# EAGLE design Puente H (EAGLE 7.6.0)
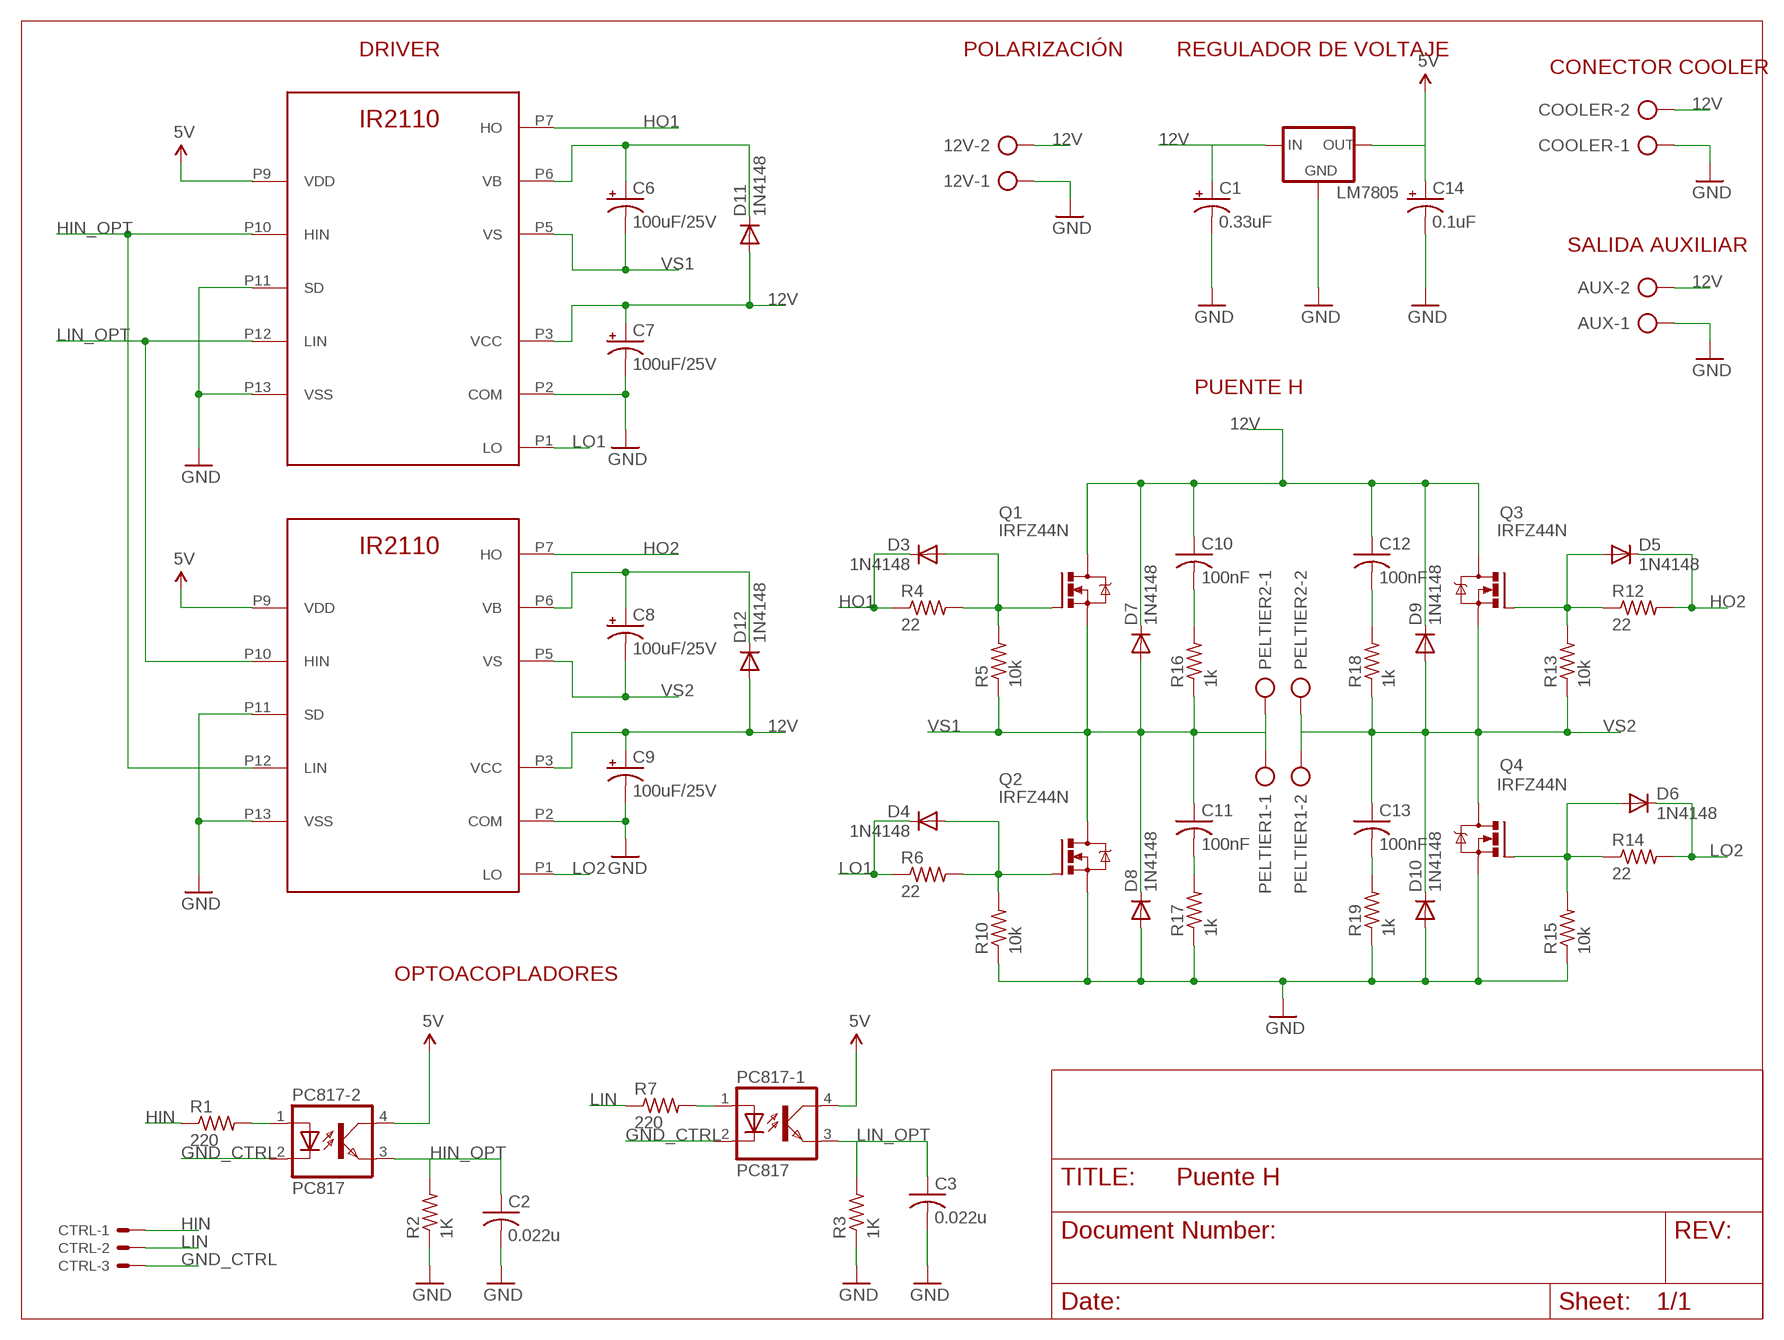
[diagram p0: schematic, sheet 1]

## Parts
12V  AK500/2  [AK500/2]
AUX  AK500/2  [AK500/2]
C1  0.33uF  CPOL-USE2.5-6  [E2,5-6]
C2  0.022u  C-US102-043X133  [C102-043X133]
C3  0.022u  C-US102-043X133  [C102-043X133]
C6  100uF/25V  CPOL-USE2.5-7  [E2,5-7]
C7  100uF/25V  CPOL-USE2.5-7  [E2,5-7]
C8  100uF/25V  CPOL-USE2.5-7  [E2,5-7]
C9  100uF/25V  CPOL-USE2.5-7  [E2,5-7]
C10  100nF  C-US025-025X050  [C025-025X050]
C11  100nF  C-US025-025X050  [C025-025X050]
C12  100nF  C-US025-025X050  [C025-025X050]
C13  100nF  C-US025-025X050  [C025-025X050]
C14  0.1uF  CPOL-USE2.5-6  [E2,5-6]
COOLER  AK500/2  [AK500/2]
CTRL  22-23-2031  [22-23-2031]
D3  1N4148  DIODE1N4148  [DIODE-1N4148]
D4  1N4148  DIODE1N4148  [DIODE-1N4148]
D5  1N4148  DIODE1N4148  [DIODE-1N4148]
D6  1N4148  DIODE1N4148  [DIODE-1N4148]
D7  1N4148  DIODE1N4148  [DIODE-1N4148]
D8  1N4148  DIODE1N4148  [DIODE-1N4148]
D9  1N4148  DIODE1N4148  [DIODE-1N4148]
D10  1N4148  DIODE1N4148  [DIODE-1N4148]
D11  1N4148  DIODE1N4148  [DIODE-1N4148]
D12  1N4148  DIODE1N4148  [DIODE-1N4148]
IR2110-1  IR2110N  [DIL14-1]
IR2110-2  IR2110N  [DIL14-1]
LM7805  78XXS  [78XXS]
PC817-1  PC817  [DIL04]
PC817-2  PC817  [DIL04]
PELTIER1  AK500/2  [AK500/2]
PELTIER2  AK500/2  [AK500/2]
Q1  IRFZ44N  IRF520  [TO220BV]
Q2  IRFZ44N  IRF520  [TO220BV]
Q3  IRFZ44N  IRF520  [TO220BV]
Q4  IRFZ44N  IRF520  [TO220BV]
R1  220  R-US_0207/10  [0207/10]
R2  1K  R-US_0207/10  [0207/10]
R3  1K  R-US_0207/10  [0207/10]
R4  22  R-US_0207/10  [0207/10]
R5  10k  R-US_0207/10  [0207/10]
R6  22  R-US_0207/10  [0207/10]
R7  220  R-US_0207/10  [0207/10]
R10  10k  R-US_0207/10  [0207/10]
R12  22  R-US_0207/10  [0207/10]
R13  10k  R-US_0207/10  [0207/10]
R14  22  R-US_0207/10  [0207/10]
R15  10k  R-US_0207/10  [0207/10]
R16  1k  R-US_0207/10  [0207/10]
R17  1k  R-US_0207/10  [0207/10]
R18  1k  R-US_0207/10  [0207/10]
R19  1k  R-US_0207/10  [0207/10]

## Nets
5V: C14.+ IR2110-1.P9(VDD) IR2110-2.P9(VDD) LM7805.OUT PC817-1.4(COL) PC817-2.4(COL)
12V: 12V.2 AUX.2 C1.+ C7.+ C9.+ C10.1 C12.1 COOLER.2 D7.C D9.C D11.A D12.A IR2110-1.P3(VCC) IR2110-2.P3(VCC) LM7805.IN Q1.D Q3.D
GND: 12V.1 AUX.1 C1.- C2.2 C3.2 C7.- C9.- C14.- COOLER.1 D8.A D10.A IR2110-1.P2(COM) IR2110-1.P11(SD) IR2110-1.P13(VSS) IR2110-2.P2(COM) IR2110-2.P11(SD) IR2110-2.P13(VSS) LM7805.GND Q2.S Q4.S R2.1 R3.1 R10.1 R15.1 R17.1 R19.1
GND_CTRL: CTRL.3 PC817-1.2(C) PC817-2.2(C)
HIN: CTRL.1 R1.1
HIN_OPT: C2.1 IR2110-1.P10(HIN) IR2110-2.P12(LIN) PC817-2.3(EMIT) R2.2
HO1: D3.C IR2110-1.P7(HO) R4.1
HO2: D5.C IR2110-2.P7(HO) R12.2
LIN: CTRL.2 R7.1
LIN_OPT: C3.1 IR2110-1.P12(LIN) IR2110-2.P10(HIN) PC817-1.3(EMIT) R3.2
LO1: D4.C IR2110-1.P1(LO) R6.1
LO2: D6.C IR2110-2.P1(LO) R14.2
N$3: PC817-1.1(A) R7.2
N$4: PC817-2.1(A) R1.2
N$6: D5.A Q3.G R12.1 R13.2
N$7: C6.+ D11.C IR2110-1.P6(VB)
N$9: D3.A Q1.G R4.2 R5.2
N$10: D4.A Q2.G R6.2 R10.2
N$11: D6.A Q4.G R14.1 R15.2
N$12: C12.2 R18.2
N$13: C10.2 R16.2
N$14: C13.2 R19.2
N$15: C11.2 R17.2
N$19: C8.+ D12.C IR2110-2.P6(VB)
VS1: C6.- C11.1 D7.A D8.C IR2110-1.P5(VS) PELTIER1.1 PELTIER2.1 Q1.S Q2.D R5.1 R16.1
VS2: C8.- C13.1 D9.A D10.C IR2110-2.P5(VS) PELTIER1.2 PELTIER2.2 Q3.S Q4.D R13.1 R18.1

## Notes on the sheet
- DRIVER | POLARIZACIÓN | REGULADOR DE VOLTAJE
- CONECTOR COOLER
- SALIDA AUXILIAR
- PUENTE H
- OPTOACOPLADORES

## Library data of the parts
12V AUX COOLER PELTIER1 PELTIER2 = con-ptr500:AK500/2: CONNECTOR; OC_FARNELL: unknown; OC_NEWARK: unknown
C1 C6-C9 C14 = rcl:CPOL-US: POLARIZED CAPACITOR, American symbol
C2 C3 C10-C13 = rcl:C-US: CAPACITOR, American symbol
CTRL = con-molex:22-23-2031: .100" (2.54mm) Center Header - 3 Pin; MF: MOLEX; MPN: 22-23-2031; OC_FARNELL: 1462950; OC_NEWARK: 30C0862
D3-D12 = SparkFun:DIODE: Diode These are standard reverse protection diodes and small signal diodes. SMA package can handle up to about 1A. SOD-323 can handle about 200mA. What the SOD-323 package when ordering, there are some mfgs out there that are 5-pin packages.
IR2110-1 IR2110-2 = PWM:IR2110
LM7805 = v-reg:78XXS: VOLTAGE REGULATOR
PC817-1 PC817-2 = optocoupler:PC817: SHARP OPTO COUPLER; MPN: PC817X4J000F; OC_FARNELL: 9707727; OC_NEWARK: 97K7059
Q1-Q4 = transistor-power:IRF520: HEXFET Power MOSFET
R1-R7 R10 R12-R19 = rcl:R-US_: RESISTOR, American symbol

## Board
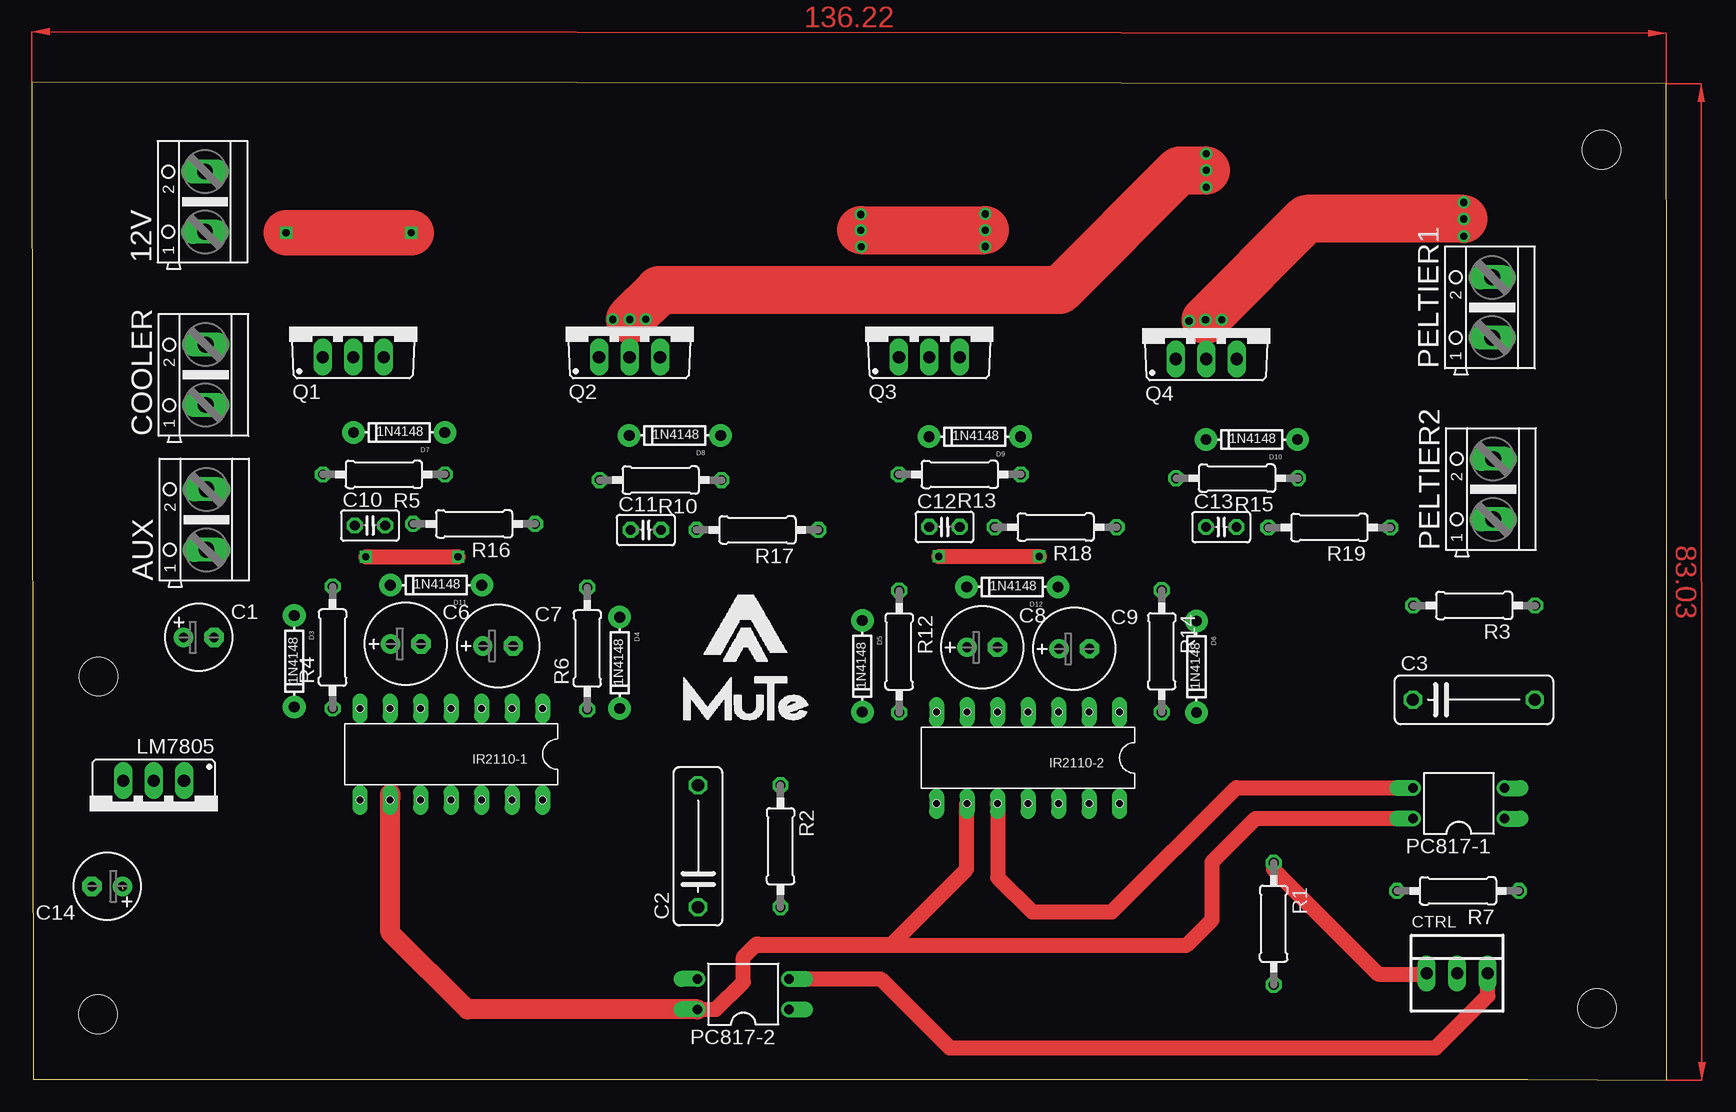
[diagram p1: board, top side]
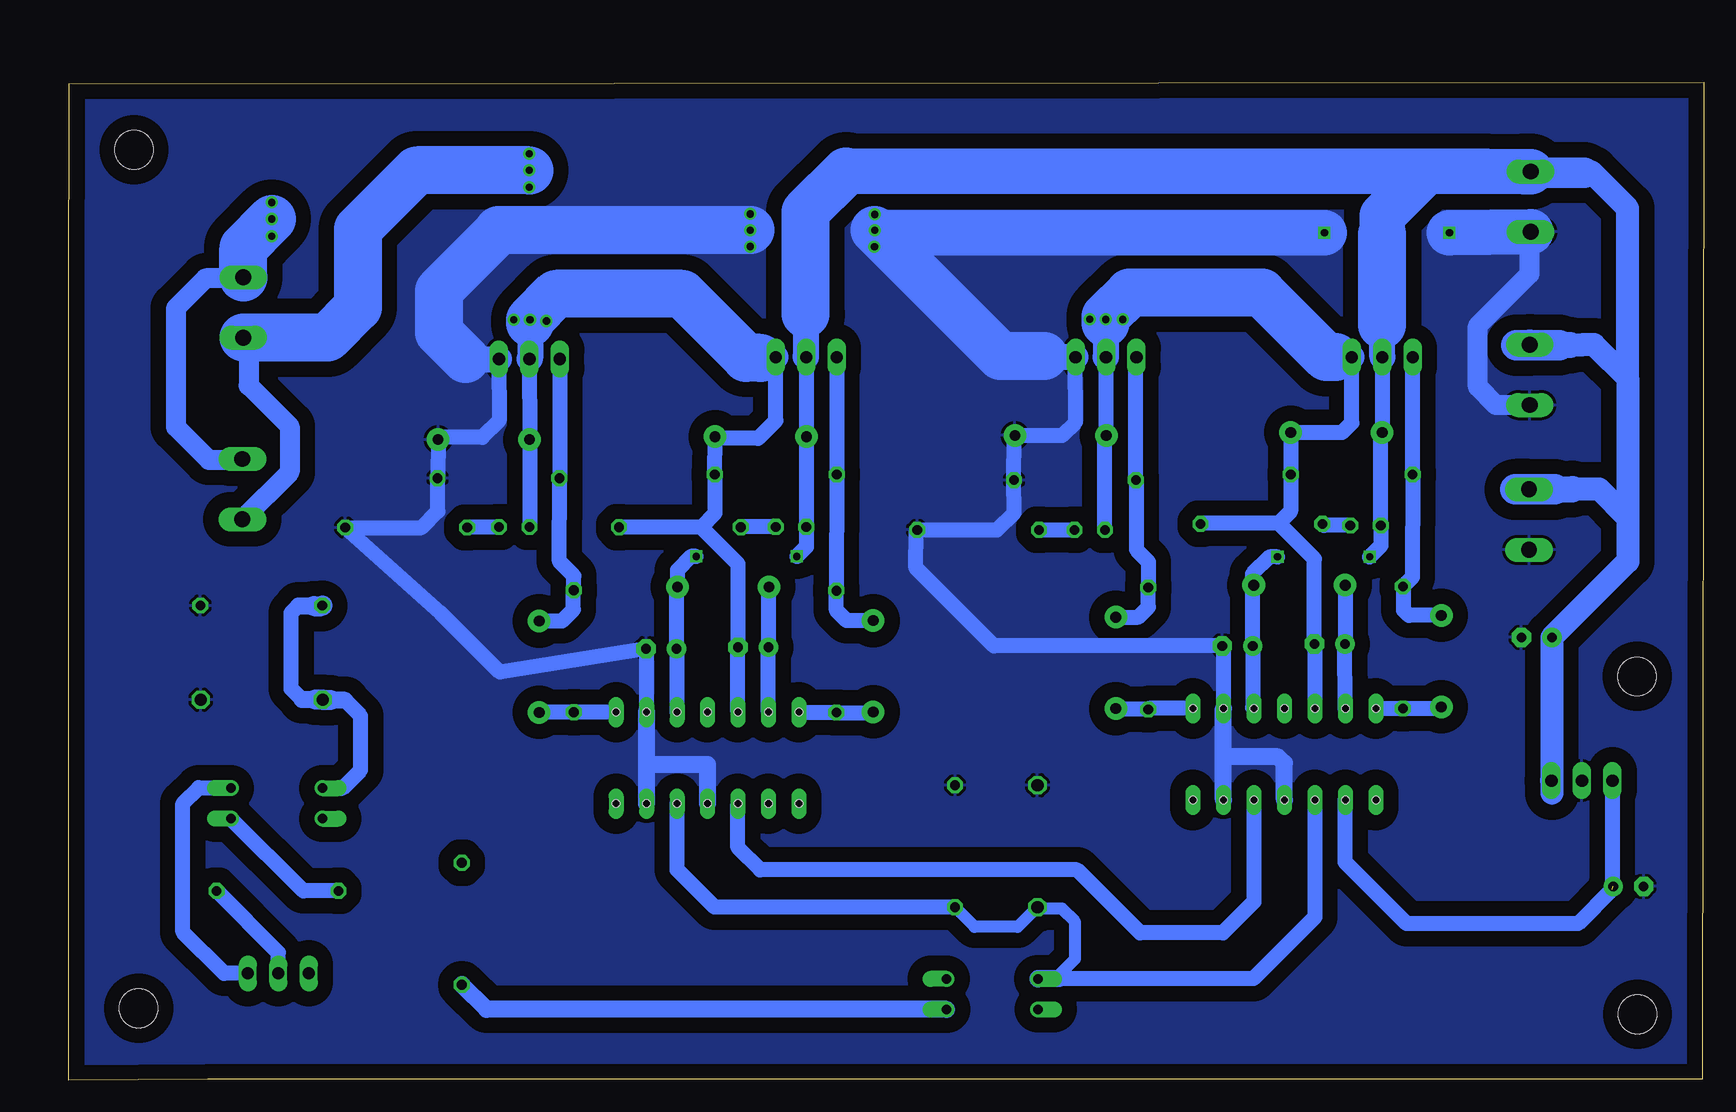
[diagram p2: board, bottom side, seen from below]

Size 136.28 x 83.16 mm. Coordinates in mm from the lower left corner, seen from the top.
Outline: 0.15,0.06 124.67,0.08 136.28,0 136.25,63.74 136.22,83.03 0,83.16 0.15,0.06
Copper layers (1*16): Top 0.035mm / dielectric 1.5mm / Bottom 0.035mm
Design rules "default": minimum track width 10mil, minimum drill 24mil, track to track 8mil, track to pad 8mil, pad to pad 8mil, via to via 8mil, smd to smd 8mil, copper to edge 40mil, drill to drill 8mil, minimum pad ring 10mil, minimum via ring 8mil, stop-mask expansion 4mil, vias tented up to drill 0mil, thermal gap 10mil
Holes 3.2 mm at 5.57,33.65 130.45,5.99 130.83,77.53 5.54,5.49

### Footprints (pad centres in the part's own frame; a part is rotated, then mirrored left to right if it is on the bottom)
AK500/2 = drill 1.321 long: 1 -2.515,0; 2 2.515,0
E2,5-6 = drill 0.813 pad 1.6: + -1.27,0 | drill 0.813 pad 1.6 octagon: - 1.27,0
C102-043X133 = drill 1.016 octagon: 1 -5.08,0; 2 5.08,0
E2,5-7 = drill 0.813 pad 1.6: + -1.27,0 | drill 0.813 pad 1.6 octagon: - 1.27,0
C025-025X050 = drill 0.813 octagon: 1 -1.27,0; 2 1.27,0
22-23-2031 = drill 1 long: 1 -2.54,0; 2 0,0; 3 2.54,0
DIODE-1N4148 = drill 0.9 pad 1.88: A -3.81,0; C 3.81,0
DIL14-1 = drill 0.406 pad 1.27 long: P1 -8.89,-3.81; P2 -6.35,-3.81; P3 -3.81,-3.81; P4 -1.27,-3.81; P5 1.27,-3.81; P6 3.81,-3.81; P7 6.35,-3.81; P8 6.35,3.81; P9 3.81,3.81; P10 1.27,3.81; P11 -1.27,3.81; P12 -3.81,3.81; P13 -6.35,3.81; P14 -8.89,3.81 | hole 0.61: -8.89,-3.81; -6.35,-3.81; -3.81,-3.81; -1.27,-3.81; 1.27,-3.81; 3.81,-3.81; 6.35,-3.81; 6.35,3.81; 3.81,3.81; 1.27,3.81; -1.27,3.81; -3.81,3.81; -6.35,3.81; -8.89,3.81
78XXS = drill 1.016 long: GND 0,-2.54; IN -2.54,-2.54; OUT 2.54,-2.54
DIL04 = drill 0.813 offset: 1 -1.27,-3.81; 2 1.27,-3.81; 3 1.27,3.81; 4 -1.27,3.81
TO220BV = drill 1.016 long: D 0,-2.54; G -2.54,-2.54; S 2.54,-2.54
0207/10 = drill 0.813 octagon: 1 -5.08,0; 2 5.08,0

### Placement (x,y rotation side)
12V  14.45,73.2 90 top
AUX  14.58,46.71 90 top
C1  13.94,36.89 0 top
C2  55.54,19.49 90 top
C3  120.19,31.7 0 top
C6  31.19,36.35 0 top
C7  38.88,36.18 0 top
C8  79.22,36.07 0 top
C9  86.89,35.94 0 top
C10  28.2,46.22 0 top
C11  51.19,45.85 0 top
C12  76.08,46.1 0 top
C13  99.14,46.09 0 top
C14  6.3,16.14 180 top
COOLER  14.51,58.77 90 top
CTRL  118.8,8.9 0 top
D3  21.89,34.91 270 top
D4  49.01,34.77 270 top
D5  69.23,34.49 270 top
D6  97.07,34.45 270 top
D7  30.63,53.97 180 top
D8  53.61,53.72 180 top
D9  78.6,53.62 180 top
D10  101.68,53.38 180 top
D11  33.71,41.25 180 top
D12  81.73,41.1 180 top
IR2110-1  33.7,27.16 180 top
IR2110-2  81.77,26.85 180 top
LM7805  10.17,22.42 180 top
PC817-1  118.94,23.07 90 top
PC817-2  59.31,7.16 90 top
PELTIER1  121.72,64.39 90 top
PELTIER2  121.8,49.25 90 top
Q1  26.81,62.79 0 top
Q2  49.83,62.79 0 top
Q3  74.82,62.79 0 top
Q4  97.88,62.64 0 top
R1  103.51,13.03 270 top
R2  62.41,19.49 270 top
R3  120.22,39.55 180 top
R4  25.09,36.05 90 top
R5  29.36,50.47 180 top
R6  46.31,35.97 90 top
R7  118.87,15.77 180 top
R10  52.42,50 180 top
R12  72.3,35.71 270 top
R13  77.35,50.47 180 top
R14  94.18,35.74 270 top
R15  100.46,50.16 180 top
R16  36.88,46.35 180 top
R17  60.49,45.85 180 top
R18  85.34,46.08 180 top
R19  108.15,46.05 180 top

### Tracks (layer width: path | path; a pad name or v marks a point on that pad's centre or on a via)
5V  (1 unrouted)
  Top 1.27: PC817-2.4 57.03,5.89 59.31,8.17 59.31,10.25 60.4,11.34 60.55,11.34 | 60.55,11.34 71.68,11.34 77.92,17.58 77.92,23 IR2110-2.P9 | PC817-1.4 101.98,21.8 98.35,18.17 98.35,13.34 96.21,11.2 60.69,11.2 60.55,11.34
  Top 1.676: PC817-2.4 36.31,5.89 29.9,12.3 29.9,23.83 29.87,23.86 29.87,23.37 IR2110-1.P9
  Bottom 1.27: LM7805.OUT 7.63,15.9 10.49,13.04 24.78,13.04 29.9,18.16 IR2110-1.P9
12V  (via drill 0.6)
  Top 1.27: v27.86,43.61 v35.54,43.61 | v75.6,43.64 v83.98,43.64
  Bottom 0.813: 14.57,61.23 9.22,61.23 6.34,58.35
  Bottom 1.27: 37.53,30.99 IR2110-1.P3 37.61,31.07 C7.+ | 37.52,36.06 C7.+ | 85.55,30.63 IR2110-2.P3 85.58,35.9 C9.+ 85.62,41.02 D12.A 85.56,41.12 85.56,42.5 84.42,43.64 v83.98,43.64 | C7.+ 37.61,41.16 D11.A 37.63,41.36 37.63,42.18 36.2,43.61 v35.54,43.61 | Q1.D 26.79,54 D7.C 26.93,53.86 C10.1 26.93,44.54 v27.86,43.61 | Q3.D D9.C | D9.C | D9.C C12.1 74.81,44.43 v75.6,43.64 | 14.57,61.23 9.51,61.23 6.31,58.03
  Bottom 1.676: 14.96,75.7 14.98,75.72 | 6.37,58.46 9.18,61.27 | 14.57,61.23 9.29,61.23 9.23,61.29 9.18,61.29
  Bottom 1.778: 10.21,61.27 10.23,61.25
  Bottom 1.93: 9.18,61.27 10.21,61.27 | 10.23,61.25 11.15,61.25 | 9.18,61.29 6.36,58.47 6.36,72.65 9.37,75.66 9.95,75.66 9.99,75.62 | 6.34,58.35 6.34,46.87 | 6.34,46.87 6.34,43.22 C1.+ 12.67,23.92 12.66,23.91 12.66,24.91 LM7805.IN | 10.96,49.26 8.73,49.26 6.34,46.87
  Bottom 2.184: 74.86,63.84 74.86,60.29 Q3.D | Q1.D 26.81,62.9 26.82,62.91 | 11.15,61.25 12.07,61.25 | 12.45,49.23 10.99,49.23 10.96,49.26
  Bottom 2.54: 12.07,61.25 15.62,61.25 15.64,61.23 14.57,61.23 COOLER.2 | 9.99,75.62 11.67,75.62 11.68,75.63 14.37,75.63 12V.2 | AUX.2 15.73,49.22 15.73,49.23 12.45,49.23
  Bottom 3.81: 71.49,75.74 23.1,75.74 | 23.1,75.74 18.16,75.74 14.98,75.72 12V.2 | 26.82,70.53 26.82,72.02 23.1,75.74
  Bottom 4: 74.86,63.84 74.88,63.86 74.88,72.35 71.49,75.74 | 26.82,62.91 26.82,70.53
GND  (via drill 0.6)
  Top 3.81: v21.21,70.62 v31.63,70.62
  Top 4: v69.11,70.83 v79.47,70.83
  Bottom 1.27: IR2110-1.P2 40.06,36.02 C7.- 59.17,36.18 65.68,42.69 65.63,45.79 R17.1 58.92,45.85 57.49,47.28 R10.1 57.48,53.66 D8.A 53.48,53.72 52.36,54.84 Q2.S | IR2110-2.P2 88.12,35.9 C9.- 100.34,34 105.25,38.91 R19.1 106.86,46.05 105.51,47.4 R15.1 105.51,50.19 D10.A 105.31,53.56 101.79,53.56 100.4,54.95 Q4.S
  Bottom 1.422: IR2110-2.P13 88.12,26.27 | 88.12,26.27 IR2110-2.P2 | IR2110-2.P11 83.02,23.06 83.02,26.32 83.07,26.27 88.12,26.27 | IR2110-1.P13 40.05,26.94 | 40.05,26.94 IR2110-1.P2 | IR2110-1.P11 34.97,26.41 35.5,26.94 40.05,26.94
  Bottom 1.676: COOLER.1 17.34,56.25 18.85,57.77 18.85,62.85 14.52,67.18 14.52,70.61 12V.1
  Bottom 2.184: Q2.S 54.9,60.24 55,60.34 | 103.2,60.08 100.44,60.08 Q4.S
  Bottom 3.81: 12V.1 v21.21,70.61 v21.21,70.62 | v31.63,70.62 68.9,70.62 v69.11,70.83
  Bottom 4: v79.47,70.83 100.46,70.83 100.46,70.74 105.43,65.77 105.43,62.31 103.2,60.08 | 55,60.34 58.62,60.34 v69.11,70.83
  other vias: 69.1,72.14 69.13,69.44 79.47,72.18 79.47,69.46
  pour Bottom (isolate 1.27): 10.91,81.76 135.18,82.03 135.2,50.63 135.23,5.94 135.25,0.87 1.33,0.9 1.37,75.11 1.41,81.81
GND_CTRL
  Top 1.27: PC817-2.2 70.75,8.43 76.5,2.68 117.02,2.68 121.35,7.01 CTRL.3
  Bottom 1.27: CTRL.3 123.32,8.9 126.76,12.34 126.76,23.06 125.44,24.38 122.79,24.38 PC817-1.2
HIN
  Top 1.27: R1.1 103.51,17.55 112.22,8.84 116.2,8.84 CTRL.1
HIN_OPT
  Bottom 1.016: R2.2 60.77,12.77 57.19,12.77 C2.1 55.43,14.3 53.51,14.3 52.4,13.19 52.4,10.11 54.08,8.43 PC817-2.3 | 55.48,8.45 55.3,8.45
  Bottom 1.27: IR2110-1.P10 32.43,13.58 37.55,8.46 53.72,8.46 53.73,8.45 | 55.48,14.35 C2.1 | R2.2 82.45,14.41 85.57,17.53 IR2110-2.P12
  Bottom 1.422: 53.73,8.45 55.48,8.45 PC817-2.3
HO1
  Bottom 1.27: IR2110-1.P7 R4.1 22.02,30.97 D3.C
HO2
  Bottom 1.27: IR2110-2.P7 72.33,30.66 R12.2 69.28,30.63 D5.C
LIN
  Bottom 1.27: CTRL.2 118.8,10.62 R7.1
LIN_OPT
  Top 1.27: IR2110-2.P10 80.5,16.88 83.37,14.01 90.03,14.01 100.4,24.38 115.09,24.38 PC817-1.3
  Bottom 1.27: PC817-1.3 113.44,24.34 111.94,25.84 111.94,30.36 113.23,31.65 | 116.83,31.71 117.73,32.61 117.73,38.93 117.13,39.53 | IR2110-1.P12 37.51,14.85 40.09,12.27 46.98,12.27 52.23,17.52 78.65,17.52 80.5,19.37 IR2110-2.P10
  Bottom 1.422: 113.23,31.65 114.45,31.65 114.47,31.67 | 115.72,31.71 116.83,31.71 | 117.13,39.53 115.88,39.53 115.85,39.5
  Bottom 1.676: 114.47,31.67 115.08,31.67 C3.1 115.71,31.7 115.72,31.71 | 115.85,39.5 115.19,39.5 R3.2
LO1
  Bottom 1.27: IR2110-1.P1 46.23,30.97 R6.1 48.94,30.89 D4.C
LO2
  Bottom 1.27: IR2110-2.P1 R14.2 97.05,30.66 D6.C
N$3
  Bottom 1.27: R7.2 116.72,15.77 PC817-1.1
N$4
  Bottom 1.422: PC817-2.1 101.45,5.89 R1.2
N$6
  Bottom 1.27: D5.A 71.45,38.3 72.3,39.15 R12.1 R13.2 Q3.G
N$7
  Bottom 1.27: IR2110-1.P6 C6.+ 29.9,35.91 D11.C
N$9
  Bottom 1.27: Q1.G R5.2 24.3,41.92 R4.2 25.02,41.06 25.02,39.15 24.59,38.72 D3.A
N$10
  Bottom 1.27: 47.29,49.95 47.31,49.97 | Q2.G 47.34,60.2 R10.2 47.31,49.97 | D4.A 47.13,38.58 46.29,39.42 46.29,41.03 R6.2 46.3,43.19 47.31,44.2 47.31,49.97
N$11
  Bottom 1.27: D6.A 95.16,38.26 94.21,39.21 94.21,40.79 R14.1 94.18,42.02 95.38,43.22 95.35,50.13 R15.2 95.34,50.2 Q4.G
N$12
  Bottom 1.27: C12.2 80.24,46.1 R18.2
N$13
  Bottom 1.27: C10.2 31.67,46.22 R16.2
N$14
  Bottom 1.27: C13.2 103.03,46.09 R19.2
N$15
  Bottom 1.27: R17.2 C11.2
N$19
  Bottom 1.27: IR2110-2.P6 C8.+ 77.95,41.07 D12.C
VS1  (via drill 0.6)
  Top 4: v49.86,63.39 52.3,65.83 85.68,65.83 95.66,75.81 v97.89,75.81
  Bottom 0.254: v48.44,63.39 v49.86,63.39 51.16,63.39 v51.18,63.41 | v97.89,77.2 v97.89,75.81 v97.89,74.4
  Bottom 1.27: IR2110-1.P5 32.44,35.89 C6.- 32.46,43.44 35.43,46.41 | 34.46,50.49 R5.1 | Q2.D D8.C 49.92,53.6 C11.1 | Q1.S 29.34,54.78 30.15,53.97 D7.A R5.1 | R5.1 34.44,47.4 35.43,46.41 | 35.43,46.41 41.9,46.41 R16.1
  Bottom 1.676: 121.28,61.77 121.28,57.89 117.86,54.47 117.86,50.67 PELTIER2.1
  Bottom 2.184: Q1.S 30.7,60.24 30.71,60.25 | 49.86,63.64 v49.86,63.39 | 49.86,63.11 49.86,60.28 Q2.D
  Bottom 3.81: 121.28,61.77 121.19,61.87
  Bottom 4: 30.71,60.25 31.46,60.25 36.84,65.63 47.87,65.63 49.86,63.64 | v49.86,63.39 49.86,63.11 | v97.89,75.81 107.27,75.81 112.17,70.91 112.17,64.39 114.69,61.87 121.19,61.87 PELTIER1.1
VS2  (via drill 0.6)
  Top 0.254: v99.18,63.36 v97.83,63.36 97.73,63.26 v96.46,63.26
  Top 4: v119.34,71.76 106.23,71.76 v97.83,63.36
  Bottom 0.254: v119.35,73.14 v119.35,71.77 v119.34,71.76 v119.34,70.31
  Bottom 1.27: IR2110-2.P5 C8.- 80.49,43 83.58,46.09 | Q4.D D10.C C13.1 | Q3.S 77.34,54.96 78.82,53.48 82.27,53.48 D9.A R13.1 82.43,47.24 83.58,46.09 | 83.58,46.09 R18.1
  Bottom 1.676: 121.82,66.8 124.86,66.8 127.34,64.32 127.34,54.44 124.59,51.69 121.88,51.69 PELTIER2.2
  Bottom 2.184: Q3.S 78.57,60.25 78.63,60.19 | 97.83,63.09 97.83,60.15 Q4.D
  Bottom 3.81: 121.82,66.8 PELTIER1.2
  Bottom 4: 78.63,60.19 79.82,60.19 85.14,65.51 95.68,65.51 v97.83,63.36 97.83,63.09 | v119.34,71.76 121.72,69.38 PELTIER1.2
(copper drawn outside any net)
  shapes: Top area x2